# EAGLE design sensor_v20 (EAGLE 7.7.0)
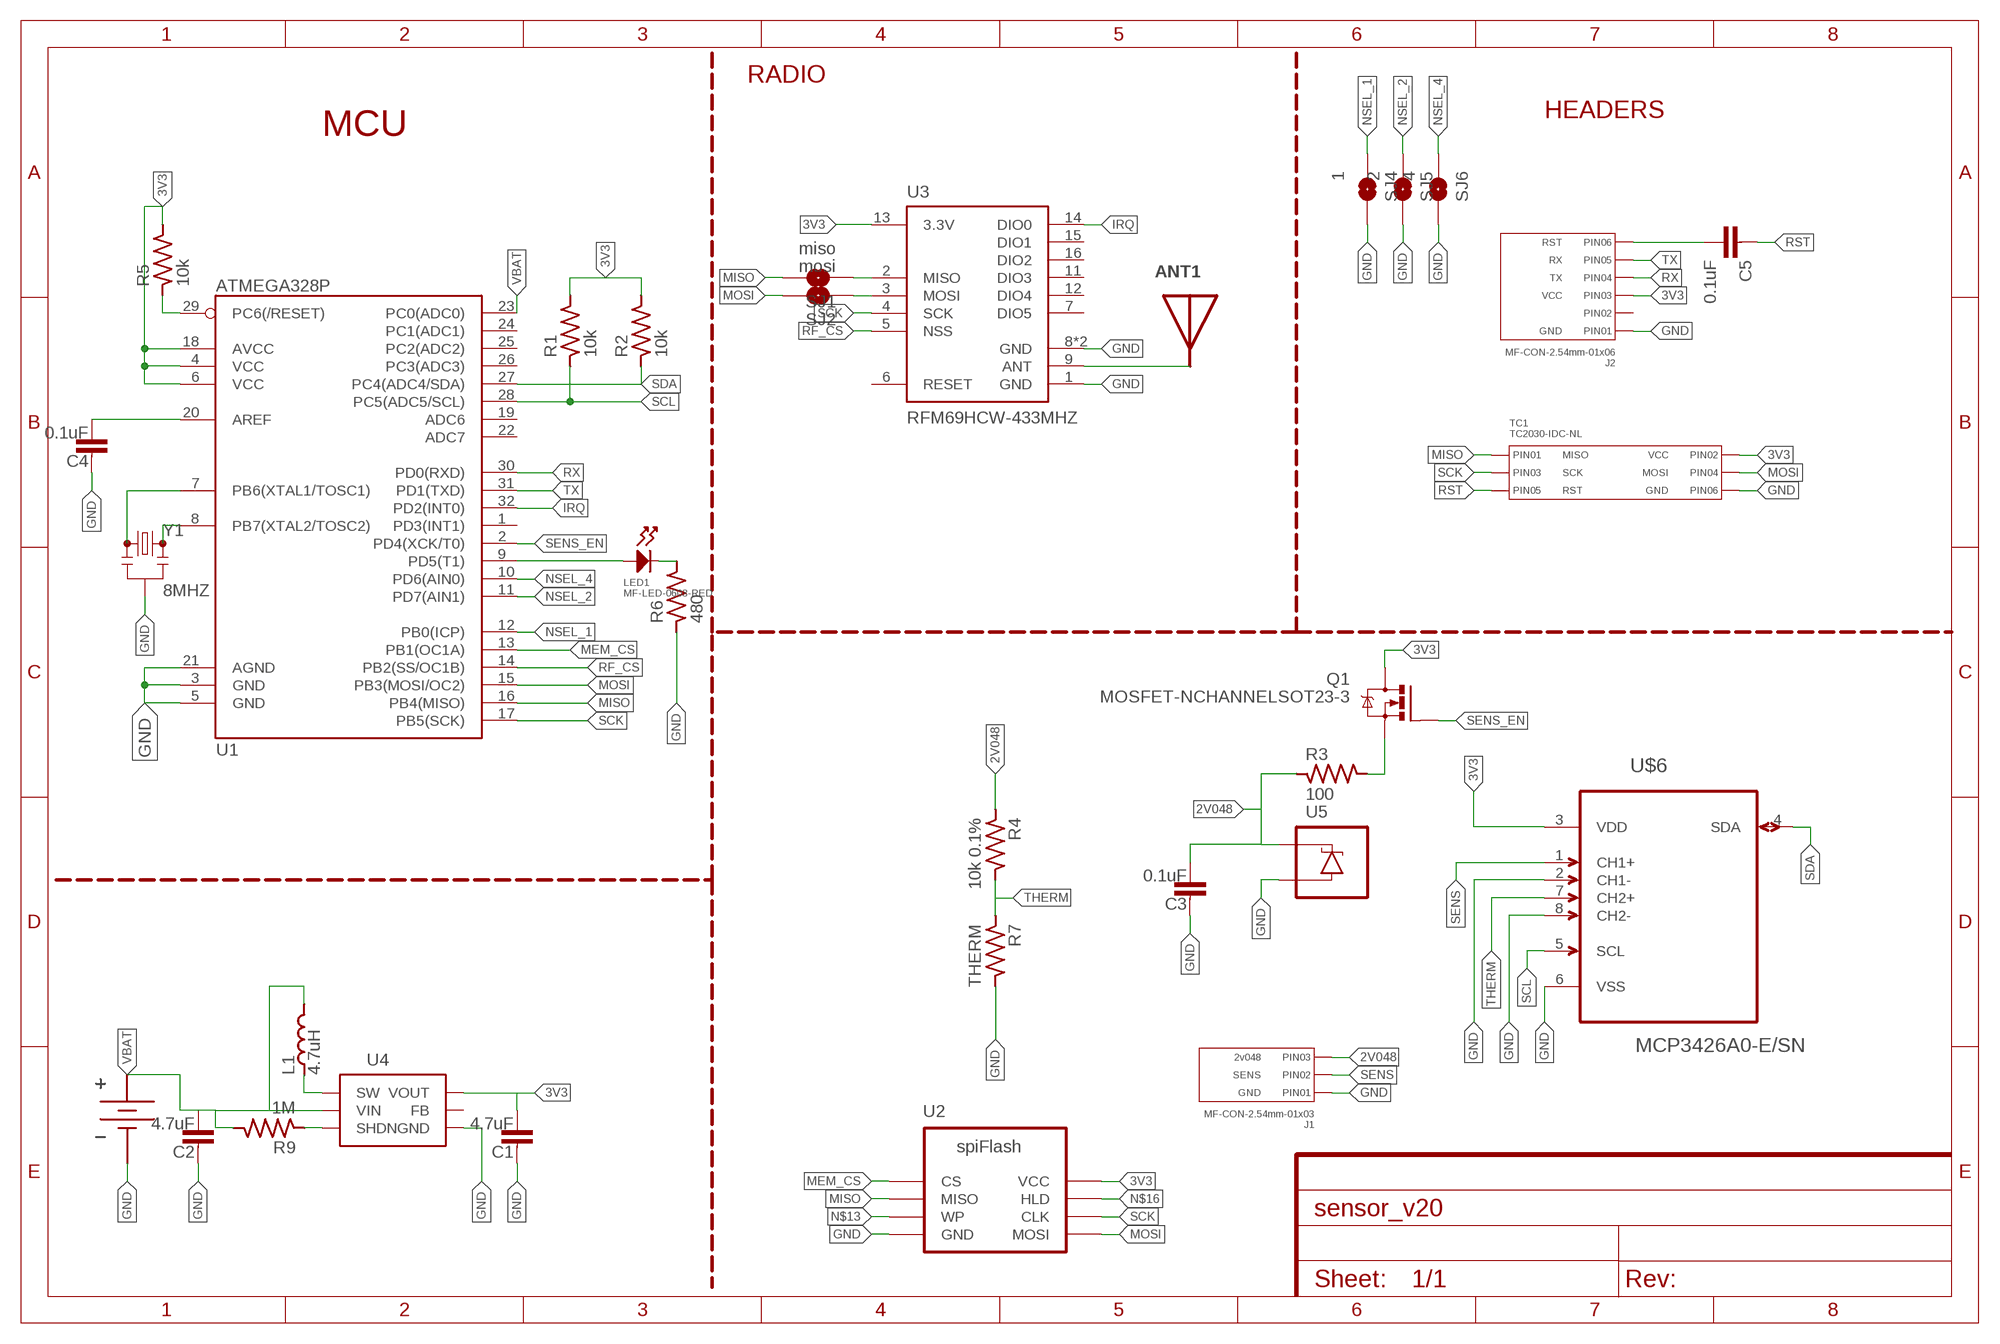
[diagram p0: schematic, sheet 1]

## Parts
ANT1  ANTENNA-433_CHIP  [ANT_433_CHIP]
C1  4.7uF  CAPACITOR_NP0603-N  [C0603-N]
C2  4.7uF  CAPACITOR_NP0603-N  [C0603-N]
C3  0.1uF  CAPACITOR_NP0603-N  [C0603-N]
C4  0.1uF  CAPACITOR_NP0603-N  [C0603-N]
C5  0.1uF  CAPACITOR0603-N  [C0603-N]
J1  MF-CON-2.54mm-01x03  CON_01X03_PTH_2.54MM  [PTH_2.54MM_01X03]
J2  MF-CON-2.54mm-01x06  CON_01X06_PTH_2.54MM  [PTH_2.54MM_01X06]
L1  4.7uH  INDUCTOR3030  [L3030]
LED1  MF-LED-0603-RED  LED_SINGLE-0603-RED  [LED0603]
Q1  MOSFET-NCHANNELSOT23-3  [SOT23-3]
R1  10k  RESISTOR0603-N  [R0603-N]
R2  10k  RESISTOR0603-N  [R0603-N]
R3  100  RESISTOR0603-N  [R0603-N]
R4  10k 0.1%  RESISTOR0603-N  [R0603-N]
R5  10k  RESISTOR0603-N  [R0603-N]
R6  480  RESISTOR0603-N  [R0603-N]
R7  THERM  RESISTOR0603-N  [R0603-N]
R9  1M  RESISTOR0603-N  [R0603-N]
SJ1  miso  SOLDERJUMPERNC2  [SJ_2S-NOTRACE]
SJ2  mosi  SOLDERJUMPERNC2  [SJ_2S-NOTRACE]
SJ4  1  SOLDERJUMPERNC2  [SJ_2S-NOTRACE]
SJ5  2  SOLDERJUMPERNC2  [SJ_2S-NOTRACE]
SJ6  4  SOLDERJUMPERNC2  [SJ_2S-NOTRACE]
TC1  TC2030-IDC-NL  CON_02X03_AVRISP_TC2030-IDC-NL  [TC2030-IDC-NL]
U1  ATMEGA328P  ATMEGA328P_SMD-AU  [TQFP32]
U2  WINBOND_FLASH_4MBIT-SOIC  [SOIC8]
U3  RFM69HCW-433MHZ  [RFM69HCW-XXXS2]
U4  AAT1217-SOT23-6  [SOT23-6]
U5  LM4040-SOT-23-3  [SOT23-3]
U$1  KEYSTONEAAHOLDER_2CELL  [KEYSTONEAAHOLDER_2CELL]
U$6  MCP3426A0-E/SN  [SOIC127P600X175-8N]
Y1  8MHZ  RESONATOR8MHZ  [RESONATOR-SMD]

## Nets
2V048: C3.2 J1.P$3(PIN3) R3.1 R4.1 U5.1(C)
3V3: C1.2 J2.P$3(PIN3) Q1.3(D) R1.2 R2.2 R5.2 TC1.P$2(PIN2) U1.4(VCC) U1.6(VCC) U1.18(AVCC) U2.8(VCC) U3.13(3.3V) U4.5(VOUT) U$6.3(VDD)
GND: C1.1 C2.1 C3.1 C4.1 J1.P$1(PIN1) J2.P$1(PIN1) R6.1 R7.2 SJ4.2 SJ5.2 SJ6.2 TC1.P$6(PIN6) U1.3(GND) U1.5(GND) U1.21(AGND) U2.4(GND) U3.1(GND) U3.8(GND) U3.10(GND) U4.2(GND) U5.2(A) U$1.P$2(GND) U$6.2(CH1-) U$6.6(VSS) U$6.8(CH2-) Y1.2
IRQ: U1.32(PD2(INT0)) U3.14(DIO0)
MEM_CS: U1.13(PB1(OC1A)) U2.1(CS)
MISO: SJ1.2 TC1.P$1(PIN1) U1.16(PB4(MISO)) U2.2(MISO)
MOSI: SJ2.2 TC1.P$4(PIN4) U1.15(PB3(MOSI/OC2)) U2.5(MOSI)
N$1: R9.1 U4.4(SHDN)
N$2: ANT1.1 U3.9(ANT)
N$3: LED1.ANODE U1.9(PD5(T1))
N$4: C4.2 U1.20(AREF)
N$5: LED1.CATHODE R6.2
N$6: L1.P$1 U4.1(SW)
N$7: U1.7(PB6(XTAL1/TOSC1)) Y1.1
N$8: U1.8(PB7(XTAL2/TOSC2)) Y1.3
N$9: SJ1.1 U3.2(MISO)
N$10: C5.2 J2.P$6(PIN6)
N$11: SJ2.1 U3.3(MOSI)
N$12: Q1.2(S) R3.2
N$13: U2.3(WP)
N$16: U2.7(HLD)
NSEL_1: SJ4.1 U1.12(PB0(ICP))
NSEL_2: SJ5.1 U1.11(PD7(AIN1))
NSEL_4: SJ6.1 U1.10(PD6(AIN0))
RF_CS: U1.14(PB2(SS/OC1B)) U3.5(NSS)
RST: C5.1 R5.1 TC1.P$5(PIN5) U1.29(PC6(/RESET))
RX: J2.P$4(PIN4) U1.30(PD0(RXD))
SCK: TC1.P$3(PIN3) U1.17(PB5(SCK)) U2.6(CLK) U3.4(SCK)
SCL: R1.1 U1.28(PC5(ADC5/SCL)) U$6.5(SCL)
SDA: R2.1 U1.27(PC4(ADC4/SDA)) U$6.4(SDA)
SENS: J1.P$2(PIN2) U$6.1(CH1+)
SENS_EN: Q1.1(G) U1.2(PD4(XCK/T0))
THERM: R4.2 R7.1 U$6.7(CH2+)
TX: J2.P$5(PIN5) U1.31(PD1(TXD))
VBAT: C2.2 L1.P$2 R9.2 U1.23(PC0(ADC0)) U4.6(VIN) U$1.P$1(VBAT)
Unconnected: J2.P$2(PIN2) U1.1(PD3(INT1)) U1.19(ADC6) U1.22(ADC7) U1.24(PC1(ADC1)) U1.25(PC2(ADC2)) U1.26(PC3(ADC3)) U3.6(RESET) U3.7(DIO5) U3.11(DIO3) U3.12(DIO4) U3.15(DIO1) U3.16(DIO2) U4.3(FB)

## Notes on the sheet
- RADIO
- HEADERS
- MCU

## Library data of the parts
ANT1 = My_RF:ANTENNA; PARTNO: 0433AT62A0020E
C1-C4 = My_Passives:CAPACITOR_NP
C5 = passives-7351:CAPACITOR
J1 = My_Connectors:CON_01X03: Library: MF_Connectors Description: Header Connector with 03 Positions and 01 Rows. Use the LABEL Attribute to label the pin on the schematic and PCB. You can remove the attributes on the PCB by using the SMASH function on the part and then deleting the text.; HOUSEPART: YES; LABEL01: GND; LABEL02: SENS; LABEL03: 2v048; MPN: MF-CON-2.54mm-01x03; PARTNO: 0022053031; POPULATE: 1; URL: https://factory.macrofab.com/part/MF-CON-2.54mm-01x03
J2 = My_Connectors:CON_01X06: Library: MF_Connectors Description: Header Connector with 6 Positions and 01 Rows. Use the LABEL Attribute to label the pin on the schematic and PCB. You can remove the attributes on the PCB by using the SMASH function on the part and then deleting the text.; HOUSEPART: YES; LABEL01: GND; LABEL03: VCC; LABEL04: TX; LABEL05: RX; LABEL06: RST; MPN: MF-CON-2.54mm-01x06; POPULATE: 1; URL: https://factory.macrofab.com/part/MF-CON-2.54mm-01x06
L1 = My_Passives:INDUCTOR
LED1 = My_LEDs:LED_SINGLE: Library: MF_LEDs Description: Device for Single LED Packages. Manufacture part number (MFG#) can be added via Attributes.; HOUSEPART: YES; MPN: MF-LED-0603-RED; POPULATE: 1; URL: https://factory.macrofab.com/part/MF-LED-0603-RED
Q1 = My_Descrete_Semiconductors:MOSFET-NCHANNEL: Common NMOSFET Parts MFG P/N Store ID Prod ID FDD8780 TRANS-09984 SI7820DN TRANS-11055 FDS6630A IC-08089 2N7002PW TRANS-11151 FQP30N06L COM-10213 TRANS-10060 BSS123LT1G TRANS-08345 BSS138 TRANS-00830 BS170 2N7000
R1-R3 R5 R6 R9 = My_Passives:RESISTOR
R4 = My_Passives:RESISTOR; PARTNO: 0.1% !!
R7 = My_Passives:RESISTOR; PARTNO: FIND PART!!
SJ1 SJ2 SJ4-SJ6 = My_Connectors:SOLDERJUMPER: Solder Jumper Standard SMD solder jumper. Used to automate production. Two varients : Normally Open and Normally Closed are the same, but have different paste layers. NC will have a large amount of paste and should jumper during reflow.
TC1 = My_Connectors:CON_02X03: Library: MF_Connectors Description: Header Connector with 6 Positions and 02 Rows. Use the LABEL Attribute to label the pin on the schematic and PCB. You can remove the attributes on the PCB by using the SMASH function on the part and then deleting the text.; HOUSEPART: NO; LABEL01: MISO; LABEL02: VCC; LABEL03: SCK; LABEL04: MOSI; LABEL05: RST; LABEL06: GND; MPN: TC2030-IDC-NL; PARTNO: NA; POPULATE: 0; URL: http://www.tag-connect.com/AVRISP
U1 = My_IC_Digital:ATMEGA328P_SMD: Atmel 32-pin 8-bit micro 16k flash.
U2 = My_IC_Digital:WINBOND_FLASH_4MBIT
U3 = My_RF:RFM69H; PARTNO: COM-13910; PROD_ID: IC-11997, IC-12053
U4 = My_IC_Power:AAT1217; PARTNO: AAT1217ICA-3.3-T1
U5 = My_Descrete_Semiconductors:LM4040; PARTNO: LM4040AIM3-2.0/NOPB
U$1 = _my-parts:KEYSTONEAAHOLDER_2CELL
U$6 = Microchip_By_element14_Batch_1:MCP3426A0-E/SN: Analog-to-Digital Converter; MPN: MCP3426A0-E/SN; OC_FARNELL: 1825012; OC_NEWARK: 52R9954; PACKAGE: SOIC-8; SUPPLIER: Microchip
Y1 = My_xTal:RESONATOR: Resonator Small SMD resonator. Used, eg, on the Arduino Pro/ Pro Mini boards. 8MHz- XTAL-08895 16MHz- XTAL-08900; PARTNO: CSTCE8M00G55-R0; PROD_ID: XTAL-08895

## Board
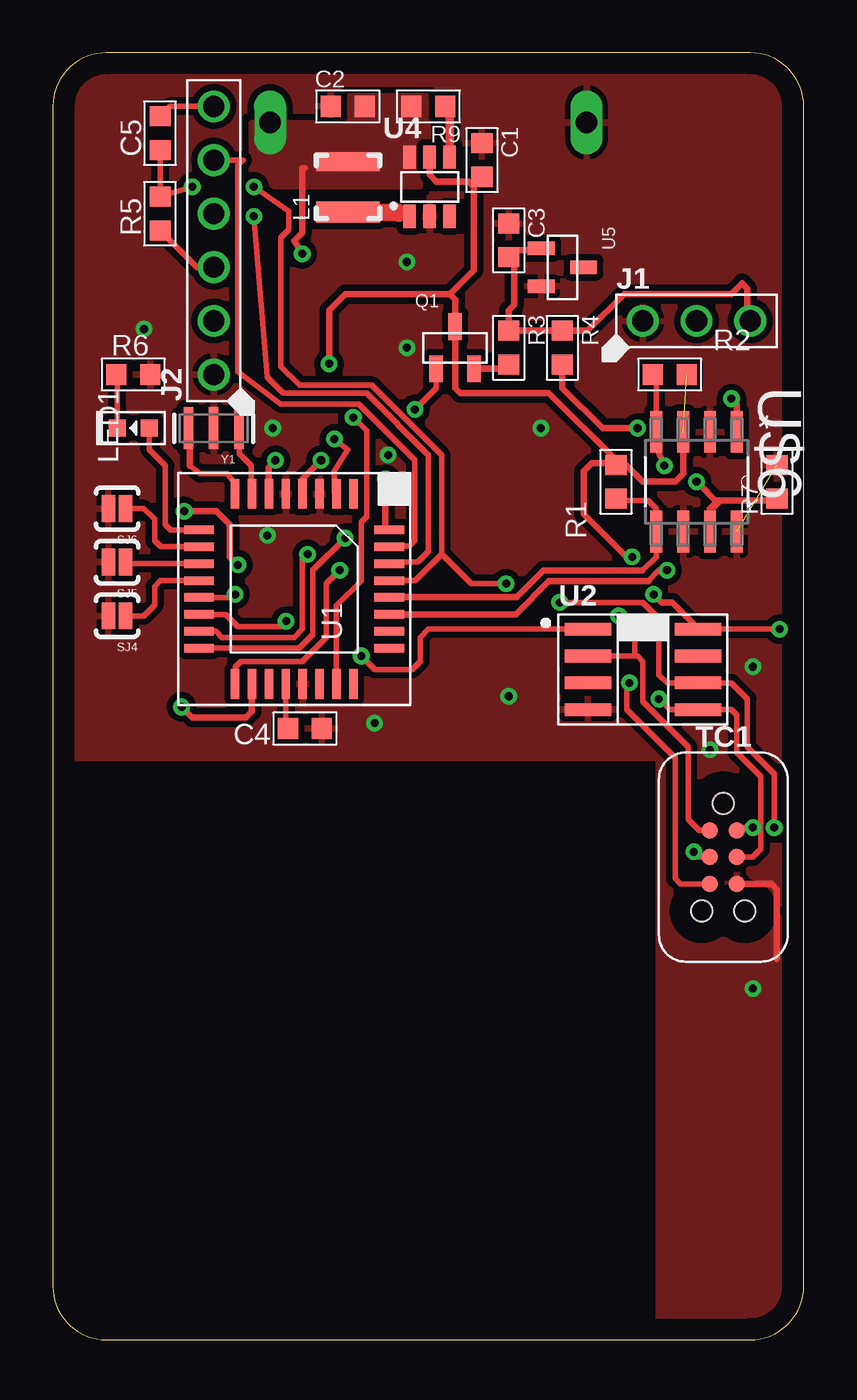
[diagram p1: board, top side]
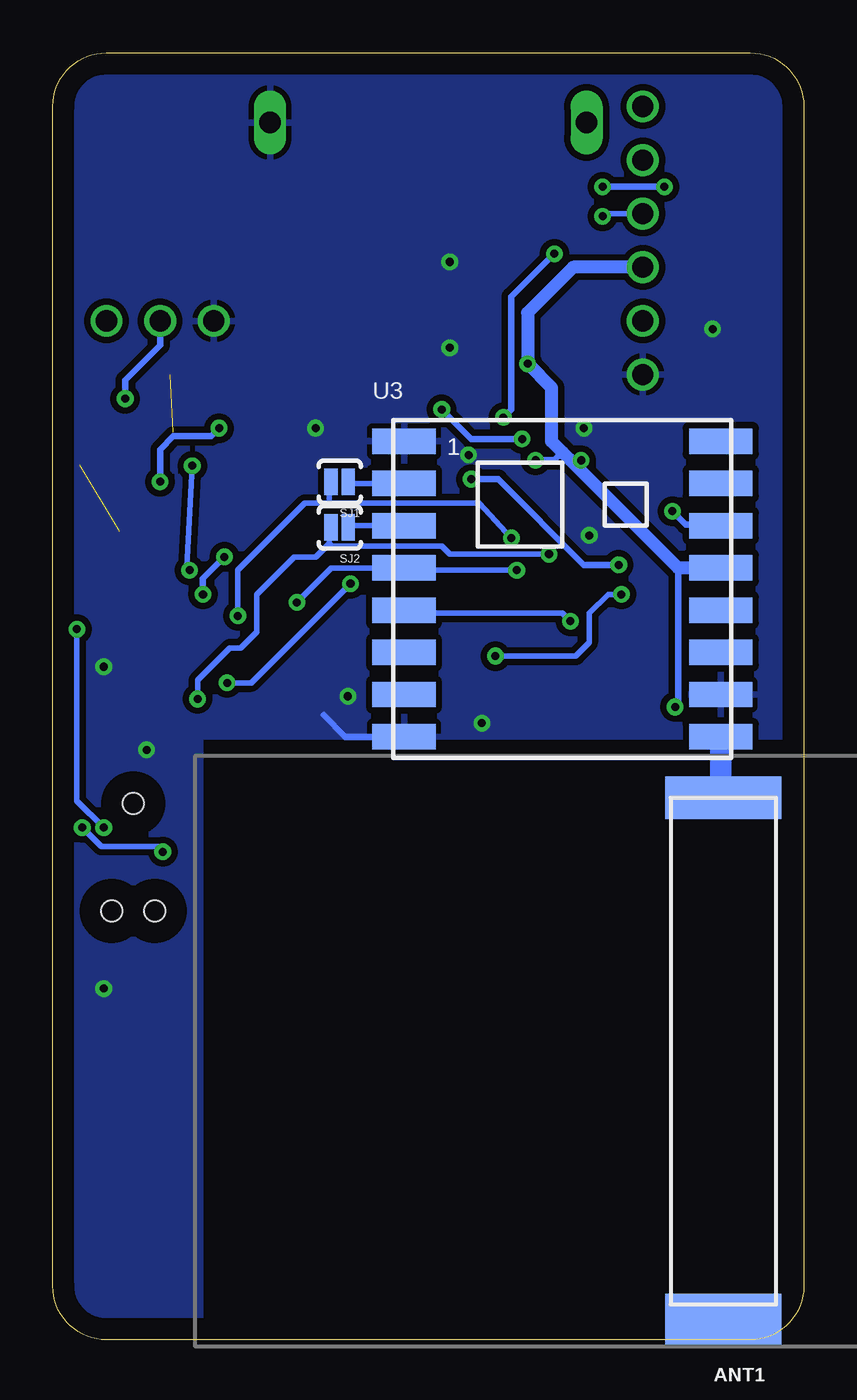
[diagram p2: board, bottom side, seen from below]

Size 35.56 x 60.96 mm. Coordinates in mm from the lower left corner, seen from the top.
Outline: 0,58.42 0,2.54 arc90 2.54,0 33.02,0 arc90 35.56,2.54 35.56,58.42 arc90 33.02,60.96 2.54,60.96 arc90 0,58.42
Copper layers (1*16): Top 0.035mm / dielectric 1.5mm / Bottom 0.035mm
Design rules "default": minimum track width 10mil, minimum drill 24mil, track to track 8mil, track to pad 8mil, pad to pad 8mil, via to via 8mil, smd to smd 8mil, copper to edge 40mil, drill to drill 8mil, minimum pad ring 10mil, minimum via ring 8mil, stop-mask expansion 4mil, vias tented up to drill 0mil, thermal gap 10mil

### Footprints (pad centres in the part's own frame; a part is rotated, then mirrored left to right if it is on the bottom)
ANT_433_CHIP = smd 5.5 x 2: 1 0,1 | smd 5.5 x 2.5: 2 0,25.75
C0603-N = smd 0.95 x 1: 1 -0.8,0; 2 0.8,0
PTH_2.54MM_01X03 = drill 1: P$1 -2.54,0; P$2 0,0; P$3 2.54,0
PTH_2.54MM_01X06 = drill 1: P$1 -6.35,0; P$2 -3.81,0; P$3 -1.27,0; P$4 1.27,0; P$5 3.81,0; P$6 6.35,0
L3030 = smd 1 x 3: P$1 -1.2,0 | smd 0.9 x 3: P$2 1.2,0
LED0603 = smd 0.8 x 0.8: ANODE 0.75,0; CATHODE -0.75,0
SOT23-3 = smd 0.635 x 1.27: 1 -0.9,-1; 2 0.9,-1; 3 0,1
R0603-N = smd 0.95 x 1: 1 -0.8,0; 2 0.8,0
SJ_2S-NOTRACE = smd 0.635 x 1.27: 1 -0.401,0; 2 0.413,0
TC2030-IDC-NL = smd 0.787 x 0.787: P$1 -1.27,-0.635; P$2 -1.27,0.635; P$3 0,-0.635; P$4 0,0.635; P$5 1.27,-0.635; P$6 1.27,0.635 | hole 0.991: 2.54,1.016; 2.54,-1.016; -2.54,0
TQFP32 = smd 1.4 x 0.4: 1 -4.5,2.8; 2 -4.5,2; 3 -4.5,1.2; 4 -4.5,0.4; 5 -4.5,-0.4; 6 -4.5,-1.2; 7 -4.5,-2; 8 -4.5,-2.8; 17 4.5,-2.8; 18 4.5,-2; 19 4.5,-1.2; 20 4.5,-0.4; 21 4.5,0.4; 22 4.5,1.2; 23 4.5,2; 24 4.5,2.8 | smd 0.4 x 1.4: 9 -2.8,-4.5; 10 -2,-4.5; 11 -1.2,-4.5; 12 -0.4,-4.5; 13 0.4,-4.5; 14 1.2,-4.5; 15 2,-4.5; 16 2.8,-4.5; 25 2.8,4.5; 26 2,4.5; 27 1.2,4.5; 28 0.4,4.5; 29 -0.4,4.5; 30 -1.2,4.5; 31 -2,4.5; 32 -2.8,4.5
SOIC8 = smd 2.2 x 0.6: 1 -2.6,1.905; 2 -2.6,0.635; 3 -2.6,-0.635; 4 -2.6,-1.905; 5 2.6,-1.905; 6 2.6,-0.635; 7 2.6,0.635; 8 2.6,1.905
RFM69HCW-XXXS2 = smd 3 x 1.2: 1 -7.5,7; 2 -7.5,5; 3 -7.5,3; 4 -7.5,1; 5 -7.5,-1; 6 -7.5,-3; 7 -7.5,-5; 8 -7.5,-7; 9 7.5,-7; 10 7.5,-5; 11 7.5,-3; 12 7.5,-1; 13 7.5,1; 14 7.5,3; 15 7.5,5; 16 7.5,7
SOT23-6 = smd 0.6 x 1.1: 1 0,0; 2 0.95,0; 3 1.9,0; 4 1.9,2.8; 5 0.95,2.8; 6 0,2.8
KEYSTONEAAHOLDER_2CELL = drill 1.016 pad 1.524 long: P$1 -7.493,27.178; P$2 7.493,27.178
SOIC127P600X175-8N = smd 1.981 x 0.559: 1 -2.362,1.905; 2 -2.362,0.635; 3 -2.362,-0.635; 4 -2.362,-1.905; 5 2.362,-1.905; 6 2.362,-0.635; 7 2.362,0.635; 8 2.362,1.905
RESONATOR-SMD = smd 0.45 x 2: 1 -1.2,0; 2 0,0; 3 1.2,0

### Placement (x,y rotation side)
ANT1  3.81,26.67 180 bottom
C1  20.32,55.88 270 top
C2  13.97,58.42 0 top
C3  21.59,52.07 270 top
C4  11.94,28.96 180 top
C5  5.08,57.15 90 top
J1  30.48,48.26 0 top
J2  7.62,52.07 90 top
L1  13.97,54.61 90 top
LED1  3.81,43.18 0 top
Q1  19.05,46.99 0 top
R1  26.67,40.64 90 top
R2  29.21,45.72 0 top
R3  21.59,46.99 270 top
R4  24.13,46.99 270 top
R5  5.08,53.34 270 top
R6  3.81,45.72 180 top
R7  34.29,40.64 90 top
R9  17.78,58.42 180 top
SJ1  21.97,40.64 180 bottom
SJ2  21.97,38.48 180 bottom
SJ4  3.05,34.29 180 top
SJ5  3.05,36.83 180 top
SJ6  3.05,39.37 180 top
TC1  31.75,22.86 270 top
U1  11.43,35.56 270 top
U2  27.94,31.75 0 top
U3  11.43,35.56 0 bottom
U4  16.89,53.21 0 top
U5  24.13,50.8 270 top
U$1  17.78,30.48 0 top
U$6  30.48,40.64 270 top
Y1  7.62,43.18 180 top

### Tracks (layer width: path | path; a pad name or v marks a point on that pad's centre or on a via)
2V048
  Top 0.305: U5.1 23.03,51.6 21.92,51.6 C3.2 21.84,51.02 21.84,49.02 21.59,48.77 R3.1 R4.1 25.31,47.79 27.05,49.53 32.13,49.53 32.64,50.04 32.89,49.78 32.89,48.39 J1.P$3
3V3  (via drill 0.38)  (1 unrouted)
  Top 0.254: U2.8 v34.42,33.66 | v33.15,24.26 32.51,24.26 TC1.P$2
  Top 0.305: v13.08,46.23 13.08,48.77 13.84,49.53 18.8,49.53 | 18.8,49.53 19.94,50.67 19.94,54.61 | 19.94,54.61 19.94,54.7 C1.2 | U1.6 10.23,41.34 v10.54,41.66 | U1.4 11.83,40.79 v12.7,41.66 | U2.8 30.54,33.72 29.34,34.92 28.83,34.92 v28.45,35.31 | v27.43,37.08 27.18,37.08 25.15,39.12 25.15,41.15 25.53,41.53 26.58,41.53 R1.2 | U$6.3 29.84,41.02 29.46,40.64 27.94,40.64 27.18,41.4 26.71,41.4 R1.2 | R1.2 26.67,41.66 23.5,44.83 19.3,44.83 19.05,45.09 Q1.3 19.05,49.28 18.8,49.53 | U4.5 17.84,55.18 18.16,54.86 19.68,54.86 19.94,54.61 | J2.P$3 6.82,50.8 R5.2 | v6.1,29.97 6.6,29.46 9.14,29.46 9.43,29.75 U1.18
  Bottom 0.254: v34.42,33.66 34.42,25.53 v33.15,24.26
  Bottom 0.305: v12.7,41.66 11.81,41.66 11.43,42.04 | v28.45,35.31 28.45,36.07 v27.43,37.08 | v10.54,41.66 11.05,41.66 11.11,41.72 | 5.95,36.56 5.95,30.11 v6.1,29.97
  Bottom 0.61: U3.13 5.95,36.56 11.11,41.72 11.43,42.04 11.94,42.55 11.94,45.09 v13.08,46.23 13.08,48.64 10.92,50.8 J2.P$3
GND  (via drill 0.38)  (1 unrouted)
  Top 0.305: TC1.P$6 34.04,21.59 34.29,21.34 34.29,18.03
  Bottom 0.305: U3.8 21.7,28.56 22.73,29.59
  other vias: 21.59,30.48 15.24,29.21 4.32,47.88 16.76,51.05 33.15,16.64 10.16,38.1 15.88,41.91 10.41,43.18 16.76,46.99 23.11,43.18 33.15,31.88 31.11,27.94
  pour Top (isolate 0.305, rank 6): -2.54,27.56 28.7,27.56 28.7,0 38.1,0 38.1,63.5 -2.54,63.5
  pour Bottom (isolate 0.305): -3.17,28.57 28.57,28.57 28.57,0 38.1,0 38.1,63.5 -6.35,63.5 -6.35,28.57
IRQ  (via drill 0.38)
  Top 0.305: v6.22,39.24 7.75,39.24 8.38,38.61 8.38,37.08 v8.76,36.7 | v15.75,40.77 15.75,38.54 U1.32
  Bottom 0.254: 3.98,38.61 U3.14
  Bottom 0.305: 3.98,38.61 5.59,38.61 v6.22,39.24 | v8.76,36.7 10.41,36.7 14.48,40.77 v15.75,40.77
MEM_CS  (via drill 0.38)
  Top 0.254: U2.1 17.78,33.66 17.4,33.27 17.4,32.13 17.02,31.75 15.24,31.75 v14.61,32.38 | 6.95,35.18 U1.13 8.49,35.16 v8.64,35.31
  Bottom 0.254: v14.61,32.38 10.79,32.38 10.16,33.02 10.16,34.42 9.27,35.31 v8.64,35.31
MISO  (via drill 0.38)
  Top 0.254: TC1.P$1 30.61,24.13 30.1,24.64 30.1,28.07 27.94,30.23 27.94,32.13 27.69,32.38 27.56,32.38 | U2.2 27.56,32.38 | 27.56,32.38 27.56,33.53 v26.8,34.29 | U1.16 11.68,32.76 12.32,33.4 12.32,36.45 v13.84,37.97
  Bottom 0.254: 22.48,39.62 15.37,39.62 v13.84,37.97 | 22.48,39.62 22.48,40.55 SJ1.2 | v26.8,34.29 26.8,36.45 23.62,39.62 22.48,39.62
MOSI  (via drill 0.38)
  Top 0.254: TC1.P$4 33.15,22.86 33.53,23.24 33.53,26.67 32.38,27.81 32.38,29.59 32.13,29.84 U2.5 29.21,29.84 v28.7,30.35 | U1.15 7.71,33.56 8,33.27 11.43,33.27 11.81,33.66 11.81,36.96 v12.06,37.21
  Bottom 0.254: v12.06,37.21 16.76,37.21 17.14,37.59 22.35,37.59 22.48,37.72 | 22.48,37.72 22.48,38.39 SJ2.2 | v28.7,30.35 28.7,31.24 27.18,32.77 26.67,32.77 25.91,33.53 25.91,35.31 24.13,37.08 23.11,37.08 22.48,37.72
N$1
  Top 0.406: U4.4 18.79,58.21 R9.1
N$2
  Bottom 1.016: U3.9 3.93,25.79 ANT1.1
N$3
  Top 0.254: U1.9 5.58,38.36 5.33,38.61 5.33,41.4 4.57,42.16 4.57,43.17 LED1.ANODE
N$4
  Top 0.254: U1.20 11.03,29.06 C4.2
N$5
  Top 0.254: LED1.CATHODE 3.06,45.67 R6.2
N$6
  Top 0.406: U4.1 16.51,53.21 16.38,53.34
  Top 0.813: L1.P$1 16.31,53.41 16.38,53.34
N$7
  Top 0.254: Y1.1 8.82,41.98 9.4,41.4 9.4,40.09 U1.7
N$8
  Top 0.254: U1.8 8.63,40.52 8.26,41.02 6.99,41.02 6.48,41.4
  Top 0.305: 6.48,41.4 6.48,43.12 Y1.3
N$9
  Bottom 0.254: U3.2 21.49,40.56 SJ1.1
N$10
  Top 0.254: J2.P$6 5.55,58.42 C5.2
N$11
  Bottom 0.254: U3.3 21.49,38.56 SJ2.1
N$12
  Top 0.305: Q1.2 21.39,45.99 R3.2
NSEL_1
  Top 0.254: U1.12 5.1,35.96 4.83,35.69 4.83,34.8 4.32,34.29 SJ4.1
NSEL_2
  Top 0.254: U1.11 3.52,36.76 SJ5.1
NSEL_4
  Top 0.254: U1.10 5.11,37.56 4.83,37.85 4.83,38.86 4.32,39.37 SJ6.1
RF_CS  (via drill 0.38)
  Top 0.254: v11.05,34.04 10.79,33.78 8.76,33.78 8.19,34.36 U1.14
  Bottom 0.254: U3.5 18.79,34.42 11.43,34.42 v11.05,34.04
RST  (via drill 0.38)
  Top 0.254: U1.29 17.16,35.96 18.41,37.21 | 18.41,37.21 18.41,41.91 15.11,45.21 11.68,45.21 10.79,46.1 10.79,52.2 11.18,52.58 11.18,53.47 v9.53,54.61 | v6.6,54.61 R5.1 C5.1 | TC1.P$5 29.72,21.59 29.46,21.84 29.46,27.56 27.18,29.84 27.18,30.99 v27.3,31.11 | v21.46,35.81 19.81,35.81 18.41,37.21
  Bottom 0.254: v27.3,31.11 26.16,31.11 v21.46,35.81
  Bottom 0.305: v6.6,54.61 v9.53,54.61
RX  (via drill 0.38)
  Top 0.254: v9.53,53.21 10.16,45.59 10.92,44.83 14.86,44.83 17.78,41.91 17.78,37.34 17.27,36.83 16,36.83 U1.30
  Bottom 0.254: J2.P$4 9.27,53.34 v9.53,53.21
SCK  (via drill 0.38)
  Top 0.254: TC1.P$3 30.61,22.86 v30.35,23.11 | v34.16,24.26 34.16,26.8 32.89,28.07 32.89,30.35 32.13,31.11 U2.6 29.08,31.11 28.7,31.5 28.7,34.16 27.94,34.92 v24,34.92 | U1.17 8.63,31.87 8.89,32.13 11.81,32.13 12.95,33.27 12.95,35.81 v13.59,36.45
  Bottom 0.254: v30.35,23.11 30.35,23.37 33.27,23.37 v34.16,24.26 | v24,34.92 22.37,36.56 U3.4 18.82,36.45 v13.59,36.45
SCL
  Top 0.254: 27.92,36.43 28.57,37.08 U$6.5 28.57,39.37 28.19,39.75 26.76,39.75 R1.1
  Top 0.305: 27.92,36.43 23.22,36.43 21.97,35.18 15.95,35.18 U1.28
SDA  (via drill 0.38)
  Top 0.254: R2.1 28.57,45.55 U$6.4 28.57,42.29 v28.96,41.4 | v29.08,36.45 28.7,36.45 28.19,35.94
  Top 0.305: U1.27 21.91,34.36 23.5,35.94 28.19,35.94
  Bottom 0.254: v28.96,41.4 29.21,36.58 v29.08,36.45
SENS  (via drill 0.38)
  Top 0.305: U$6.1 32.38,44.32 v32.13,44.58
  Bottom 0.305: v32.13,44.58 32.13,45.47 30.48,47.12 J1.P$2
SENS_EN  (via drill 0.38)
  Top 0.254: Q1.1 18.16,45.98 18.16,45.09 v17.14,44.07 | v13.34,42.67 13.97,42.16 13.34,41.15 13.34,40.16 U1.2
  Bottom 0.305: v13.34,42.67 15.75,42.67 v17.14,44.07
THERM  (via drill 0.38)
  Top 0.305: R7.1 34.2,39.75 31.5,39.75 31.11,39.37 U$6.7 31.11,39.24 31.5,39.62 v30.48,40.64 | v27.69,43.18 26.04,43.18 24.13,45.09 R4.2
  Bottom 0.305: v30.48,40.64 30.48,42.16 29.84,42.8 28.07,42.8 v27.69,43.18
TX
  Top 0.254: J2.P$5 9.02,55.88 8.76,55.63 8.76,45.85 10.79,44.32 14.48,44.32 17.14,41.66 17.14,37.85 16.89,37.59 15.96,37.59 U1.31
VBAT  (via drill 0.38)
  Top 0.254: U1.23 13.43,34.77 14.61,35.94 14.61,38.73 14.86,38.99 14.86,43.05 v14.22,43.69
  Top 0.305: v11.81,51.44 11.43,52.07 11.81,52.45 11.81,55.5 11.94,55.5
  Bottom 0.305: v14.22,43.69 13.84,44.07 13.84,49.4 v11.81,51.44
  pour Top (isolate 0.305, no thermals): 13.97,58.93 13.97,57.66 9.4,57.66 9.4,54.61 17.4,54.61 17.4,56.39 17.78,56.39 17.78,58.93